# EAGLE schematic SRC01 (EAGLE 7.6.0)
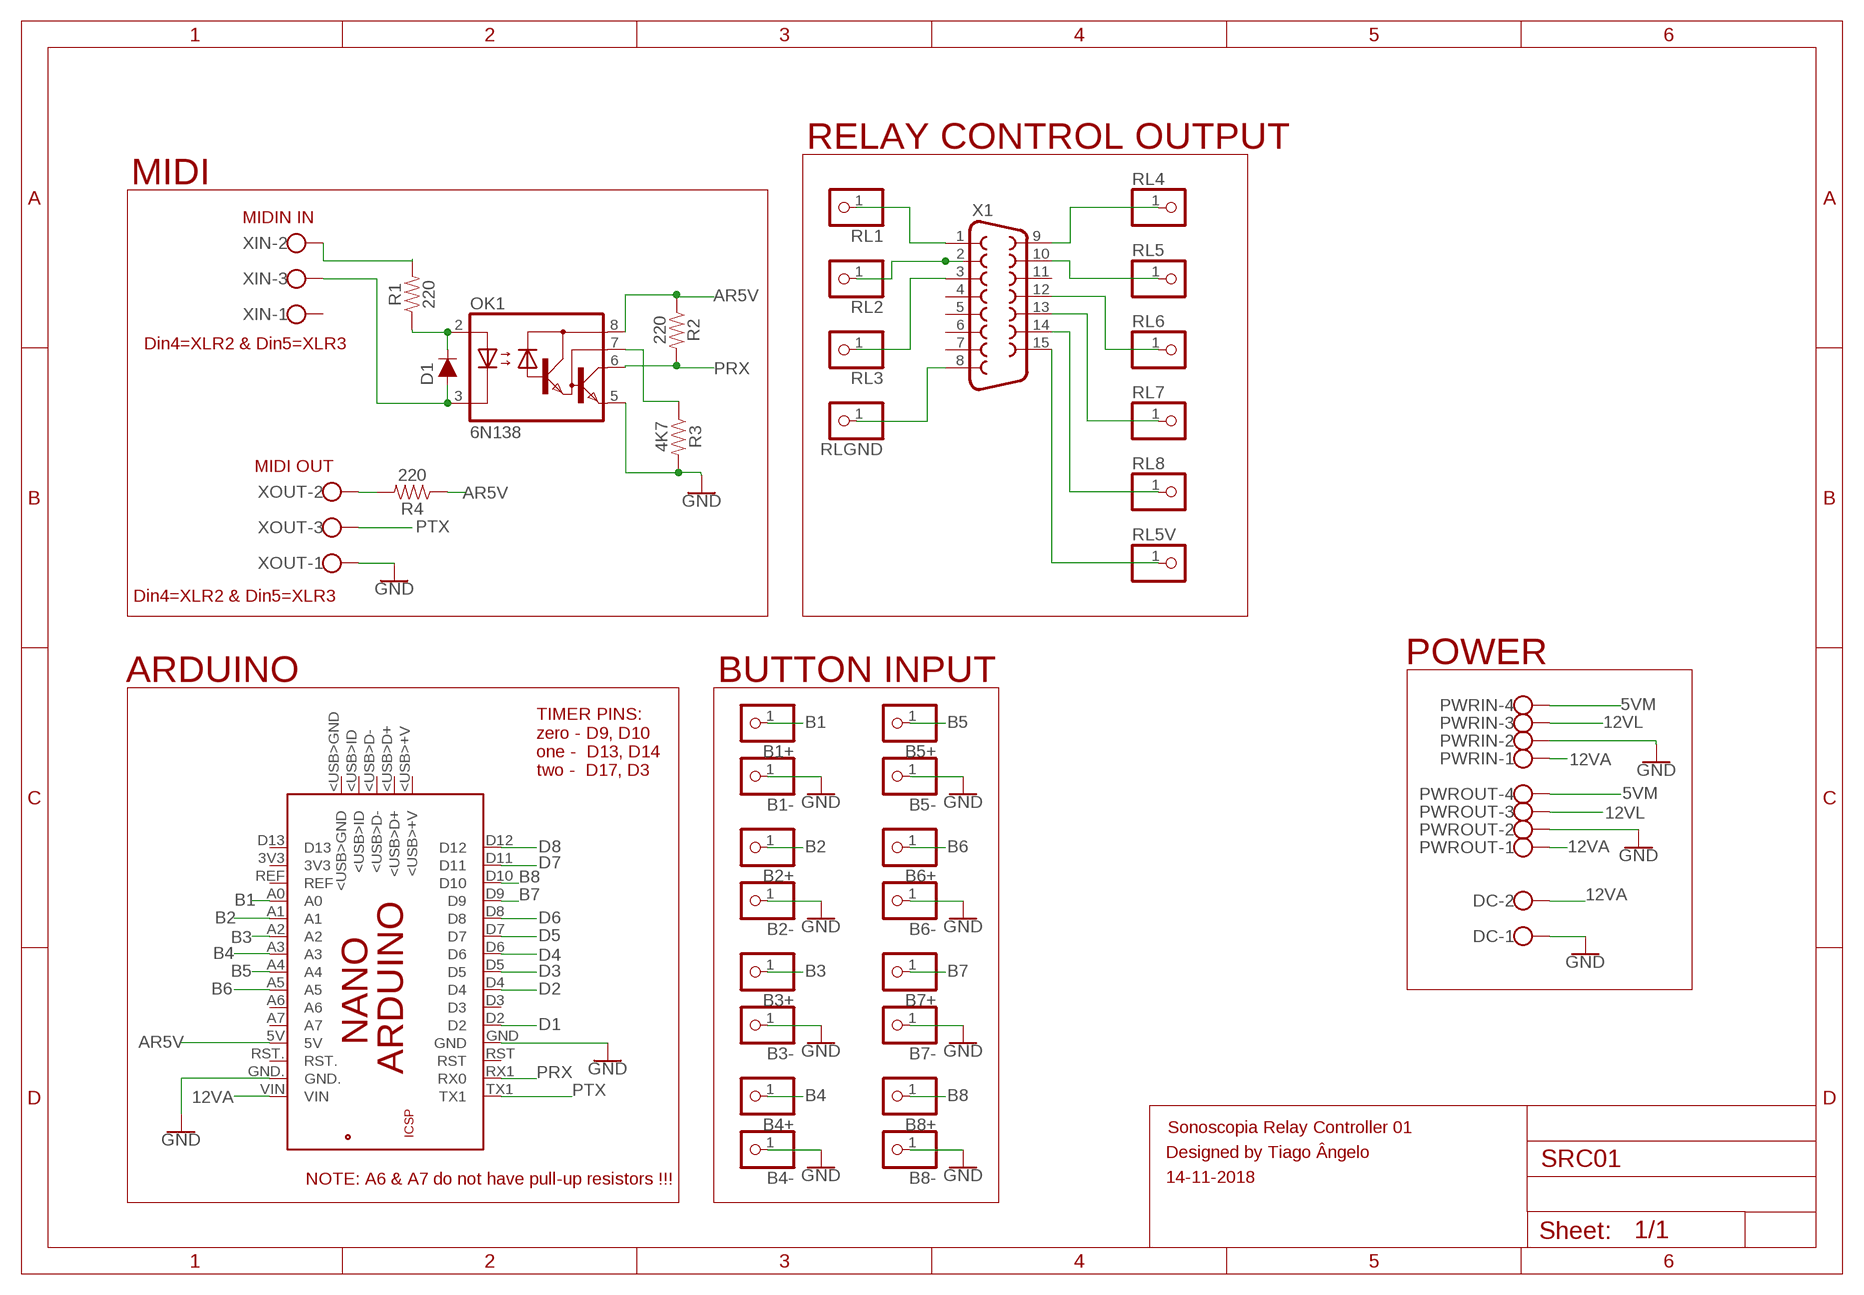
[diagram p0: schematic, sheet 1]

## Parts
B1+  PINHD-1X1  [1X01]
B1-  PINHD-1X1  [1X01]
B2+  PINHD-1X1  [1X01]
B2-  PINHD-1X1  [1X01]
B3+  PINHD-1X1  [1X01]
B3-  PINHD-1X1  [1X01]
B4+  PINHD-1X1  [1X01]
B4-  PINHD-1X1  [1X01]
B5+  PINHD-1X1  [1X01]
B5-  PINHD-1X1  [1X01]
B6+  PINHD-1X1  [1X01]
B6-  PINHD-1X1  [1X01]
B7+  PINHD-1X1  [1X01]
B7-  PINHD-1X1  [1X01]
B8+  PINHD-1X1  [1X01]
B8-  PINHD-1X1  [1X01]
D1  200mA/100V/1V  DIODE-1N4148  [DIODE-1N4148]
DC  W237-102  [W237-102]
OK1  6N138  [DIL08]
PCB1  ARDUINO_NANO  [ARDUINO_NANO]
PWRIN  W237-4  [W237-4]
PWROUT  W237-4  [W237-4]
R1  220  1KOHM-HORIZ-1/4W-5%  [AXIAL-0.3]
R2  220  1KOHM-HORIZ-1/4W-5%  [AXIAL-0.3]
R3  4K7  1KOHM-HORIZ-1/4W-5%  [AXIAL-0.3]
R4  220  1KOHM-HORIZ-1/4W-5%  [AXIAL-0.3]
RL1  PINHD-1X1  [1X01]
RL2  PINHD-1X1  [1X01]
RL3  PINHD-1X1  [1X01]
RL4  PINHD-1X1  [1X01]
RL5  PINHD-1X1  [1X01]
RL5V  PINHD-1X1  [1X01]
RL6  PINHD-1X1  [1X01]
RL7  PINHD-1X1  [1X01]
RL8  PINHD-1X1  [1X01]
RLGND  PINHD-1X1  [1X01]
X1  F15HDV  [HDF15V]
XIN  W237-103  [W237-103]
XOUT  W237-103  [W237-103]

## Nets
5VM [5VM]: PWRIN.4 PWROUT.4
12VA [12VA]: DC.2 PCB1.VIN PWRIN.1 PWROUT.1
12VL [12VL]: PWRIN.3 PWROUT.3
AR5V: OK1.8(VCC) PCB1.5V R2.P$1 R4.P$1
B1: B1+.1 PCB1.A0
B2: B2+.1 PCB1.A1
B3: B3+.1 PCB1.A2
B4: B4+.1 PCB1.A3
B5: B5+.1 PCB1.A4
B6: B6+.1 PCB1.A5
B7: B7+.1 PCB1.D9
B8: B8+.1 PCB1.D10
D1: PCB1.D2
D2: PCB1.D4
D3: PCB1.D5 RL3.1 X1.3
D4: PCB1.D6
D5: PCB1.D7
D6: PCB1.D8
D7: PCB1.D11
D8: PCB1.D12
GND [GND]: B1-.1 B2-.1 B3-.1 B4-.1 B5-.1 B6-.1 B7-.1 B8-.1 DC.1 OK1.5(GND) PCB1.GND PCB1.GND. PWRIN.2 PWROUT.2 R3.P$2 XOUT.1
N$1: RL5V.1 X1.15
N$2: R4.P$2 XOUT.2
N$3: RL8.1 X1.14
N$4: RL6.1 X1.12
N$5: RL7.1 X1.13
N$6: RL5.1 X1.10
N$7: RL4.1 X1.9
N$8: RLGND.1 X1.8
N$9: RL2.1 X1.2
N$10: RL1.1 X1.1
N$25: D1.A OK1.3(C) XIN.3
N$26: D1.C OK1.2(A) R1.P$1
N$27: R1.P$2 XIN.2
N$29: OK1.7(VB) R3.P$1
PRX: OK1.6(VO) PCB1.RX1(RX0) R2.P$2
PTX: PCB1.TX1 XOUT.3
Unconnected: PCB1.3V3 PCB1.5V. PCB1.<USB>+V PCB1.<USB>D+ PCB1.<USB>D- PCB1.<USB>GND PCB1.<USB>ID PCB1.A6 PCB1.A7 PCB1.D3 PCB1.D13 PCB1.GND_ PCB1.MISO PCB1.MOSI PCB1.REF PCB1.RESET.. PCB1.RST PCB1.RST. PCB1.SCK X1.4 X1.5 X1.6 X1.7 X1.11 XIN.1

## Notes on the sheet
- RELAY CONTROL OUTPUT
- MIDI
- MIDIN IN
- Din4=XLR2 & Din5=XLR3
- MIDI OUT
- Din4=XLR2 & Din5=XLR3
- POWER
- ARDUINO | BUTTON INPUT
- TIMER PINS:
  zero - D9, D10
  one -  D13, D14
  two -  D17, D3
- Sonoscopia Relay Controller 01
- Designed by Tiago Ângelo
- NOTE: A6 & A7 do not have pull-up resistors !!! | 14-11-2018

## Library data of the parts
B1+ B1- B2+ B2- B3+ B3- B4+ B4- B5+ B5- B6+ B6- B7+ B7- B8+ B8- RL1-RL5 RL5V RL6-RL8 RLGND = adafruit:PINHD-1X1: Pin header 1x1 for 0.1" spacing With round pins
D1 = SparkFun-DiscreteSemi:DIODE: Diode These are standard reverse protection diodes and small signal diodes. SparkFun Products: SparkFun SparkPunk Sound Kit <https://www.sparkfun.com/products/11177> SparkFun ESP8266 Thing <https://www.sparkfun.com/products/13231>; PROD_ID: DIO-08378
DC = con-wago-500:W237-102: WAGO SCREW CLAMP; MPN: 237-102; OC_FARNELL: unknown; OC_NEWARK: 70K9898
OK1 = optocoupler:6N138: MOTOROLA OPTO COUPLER; MF: VISHAY/TELEFUNKEN; MPN: 6N138; OC_FARNELL: 9860150; OC_NEWARK: 35K5294
PCB1 = E14_Arduino_revC:ARDUINO_NANO: Device for representing an Arduino Nano board with a footprint in an EAGLE design. Created by Dave Young for Element14. More EAGLE documentation at: http://www.element14.com/community/community/knode/cadsoft_eagle
PWRIN PWROUT = con-wago-500:W237-4: WAGO SCREW CLAMP; OC_FARNELL: unknown; OC_NEWARK: unknown
R1-R4 = SparkFun-Resistors:1KOHM: 1kΩ resistor A resistor is a passive two-terminal electrical component that implements electrical resistance as a circuit element. Resistors act to reduce current flow, and, at the same time, act to lower voltage levels within circuits. - Wikipedia; PROD_ID: RES-08380; VALUE: 1k
X1 = adafruit:F15: SUB-D HDH is also known as a 'right angle VGA' connector
XIN XOUT = con-wago-500:W237-103: WAGO SCREW CLAMP; MPN: 237-103; OC_FARNELL: unknown; OC_NEWARK: 18M7116

## Net classes
0 default: width 0.508 mm, drill 0.508 mm, clearance 0.406 mm
1 GND: width 1.016 mm, drill 0.508 mm, clearance 0.508 mm
2 5VM: width 1.016 mm, drill 0.508 mm, clearance 0.508 mm
3 12VL: width 0.61 mm, drill 0.508 mm, clearance 0.508 mm
4 12VA: width 0.508 mm, drill 0.508 mm, clearance 0.508 mm
5 AR5V: width 0.406 mm, drill 0.508 mm, clearance 0.508 mm
6 PTX: width 0.406 mm, drill 0.508 mm, clearance 0.508 mm
7 PRX: width 0.406 mm, drill 0.508 mm, clearance 0.508 mm